# EAGLE design resisitive pos servo2 (EAGLE 6.5.0)
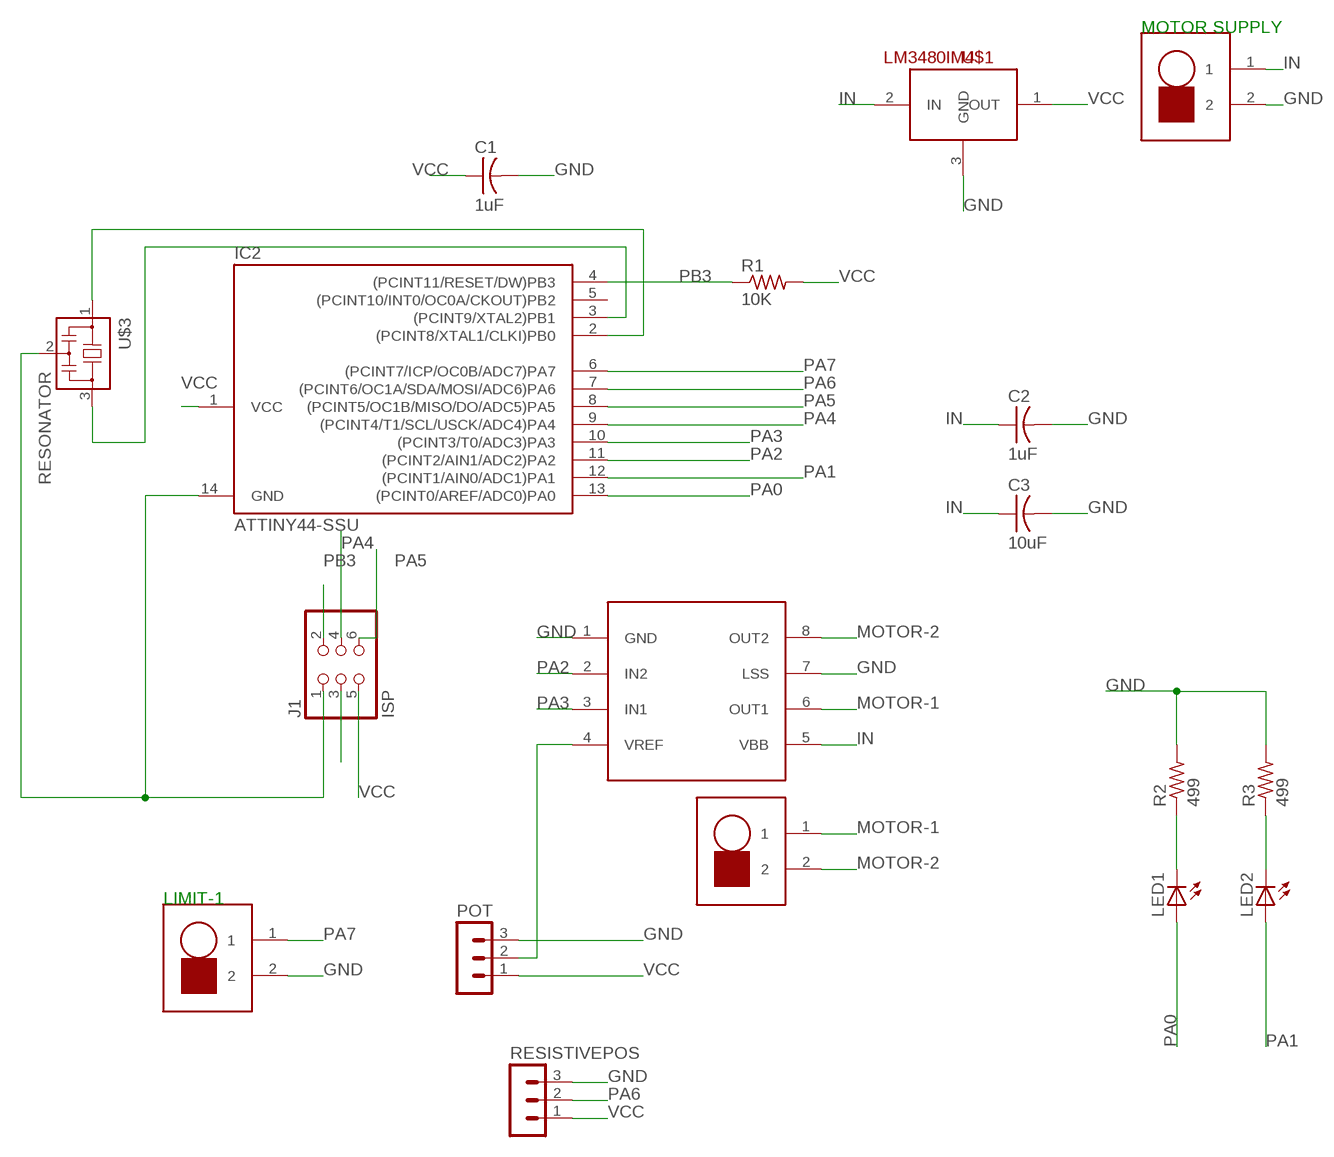
[diagram p0: schematic, sheet 1]

## Parts
C1  1uF  CAP-US1206  [C1206]
C2  1uF  CAP-US1206  [C1206]
C3  10uF  CAP-US1206  [C1206]
IC2  ATTINY44-SSU  [SOIC14]
J1  ISP  PINHD-2X3-SMD  [2X03SMD]
LED1  LEDSMT1206  [1206]
LED2  LEDSMT1206  [1206]
MOTOR-SUPPLY  3.5MMSCREWTERMINAL2  [SCREWTERMINAL-3.5MM-2-NS]
POT  MA03-1  [MA03-1]
R1  10K  RES-US1206FAB  [R1206FAB]
R2  499  RES-US1206FAB  [R1206FAB]
R3  499  RES-US1206FAB  [R1206FAB]
RESISTIVEPOS  MA03-1  [MA03-1]
U$1  LM3480IM4  [SOT23-3]
U$2  3.5MMSCREWTERMINAL2  [SCREWTERMINAL-3.5MM-2-NS]
U$3  RESONATOR  [EFOBM]
U$5  3.5MMSCREWTERMINAL2  [SCREWTERMINAL-3.5MM-2-NS]
U$6  A4953-H-BRIDGE-MOTOR-DRIVER  [SOIC8]

## Nets
GND: C1.2 C2.2 C3.2 IC2.14(GND) J1.1 MOTOR-SUPPLY.2 POT.3 R2.2 R3.2 RESISTIVEPOS.3 U$1.3(GND) U$3.2 U$5.2 U$6.1(GND) U$6.7(LSS)
IN: C2.1 C3.1 MOTOR-SUPPLY.1 U$1.2(IN) U$6.5(VBB)
MOTOR-1: U$2.1 U$6.6(OUT1)
MOTOR-2: U$2.2 U$6.8(OUT2)
N$1: LED1.C R2.1
N$2: IC2.3((PCINT9/XTAL2)PB1) U$3.3
N$3: IC2.2((PCINT8/XTAL1/CLKI)PB0) U$3.1
N$4: LED2.C R3.1
N$5: POT.2 U$6.4(VREF)
PA0: IC2.13((PCINT0/AREF/ADC0)PA0) LED1.A
PA1: IC2.12((PCINT1/AIN0/ADC1)PA1) LED2.A
PA2: IC2.11((PCINT2/AIN1/ADC2)PA2) U$6.2(IN2)
PA3: IC2.10((PCINT3/T0/ADC3)PA3) U$6.3(IN1)
PA4: IC2.9((PCINT4/T1/SCL/USCK/ADC4)PA4) J1.4
PA5: IC2.8((PCINT5/OC1B/MISO/DO/ADC5)PA5) J1.6
PA6: IC2.7((PCINT6/OC1A/SDA/MOSI/ADC6)PA6) J1.3 RESISTIVEPOS.2
PA7: IC2.6((PCINT7/ICP/OC0B/ADC7)PA7) U$5.1
PB3: IC2.4((PCINT11/RESET/DW)PB3) J1.2 R1.1
VCC: C1.1 IC2.1(VCC) J1.5 POT.1 R1.2 RESISTIVEPOS.1 U$1.1(OUT)
Unconnected: IC2.5((PCINT10/INT0/OC0A/CKOUT)PB2)

## Notes on the sheet
- MOTOR SUPPLY
- LIMIT-1

## Library data of the parts
C1-C3 = fab:CAP-US
IC2 = fab:ATTINY44
J1 = fab:PINHD-2X3-SMD: PIN HEADER
LED1 LED2 = adafruit:LED: LED OSRAM: - CHIPLED LG R971, LG N971, LY N971, LG Q971, LY Q971, LO R971, LY R971 LH N974, LH R974 LS Q976, LO Q976, LY Q976 LO Q996 - Hyper CHIPLED LW Q18S LB Q993, LB Q99A, LB R99A - SideLED LS A670, LO A670, LY A670, LG A670, LP A670 LB A673, LV A673, LT A673, LW A673 LH A674 LY A675 LS A676, LA A676, LO A676, LY A676, LW A676 LS A679, LY A679, LG A679 - Hyper Micro SIDELED® LS Y876, LA Y876, LO Y876, LY Y876 LT Y87S - SmartLED LW L88C, LW L88S LB L89C, LB L89S, LG L890 LS L89K, LO L89K, LY L89K LS L896, LA L896, LO L896, LY L896 - TOPLED LS T670, LO T670, LY T670, LG T670, LP T670 LSG T670, LSP T670, LSY T670, LOP T670, LYG T670 LG T671, LOG T671, LSG T671 LB T673, LV T673, LT T673, LW T673 LH T674 LS T676, LA T676, LO T676, LY T676, LB T676, LH T676, LSB T676, LW T676 LB T67C, LV T67C, LT T67C, LS T67K, LO T67K, LY T67K, LW E67C LS E67B, LA E67B, LO E67B, LY E67B, LB E67C, LV E67C, LT E67C LW T67C LS T679, LY T679, LG T679 LS T770, LO T770, LY T770, LG T770, LP T770 LB T773, LV T773, LT T773, LW T773 LH T774 LS E675, LA E675, LY E675, LS T675 LS T776, LA T776, LO T776, LY T776, LB T776 LHGB T686 LT T68C, LB T68C - Hyper Mini TOPLED® LB M676 - Mini TOPLED Santana® LG M470 LS M47K, LO M47K, LY M47K Source: http://www.osram.convergy.de/
MOTOR-SUPPLY U$2 U$5 = cw:3.5MMSCREWTERMINAL2
POT RESISTIVEPOS = con-lstb:MA03-1: PIN HEADER; OC_FARNELL: unknown; OC_NEWARK: unknown
R1-R3 = fab:RES-US: Resistor (US Symbol) Variants with postfix FAB are widened to allow the routing of internal traces
U$1 = SparkFun-PowerIC:LM3480IM4: Small package linear regulator
U$3 = fab:RESONATOR
U$6 = fab:A4953-H-BRIDGE-MOTOR-DRIVER

## Board
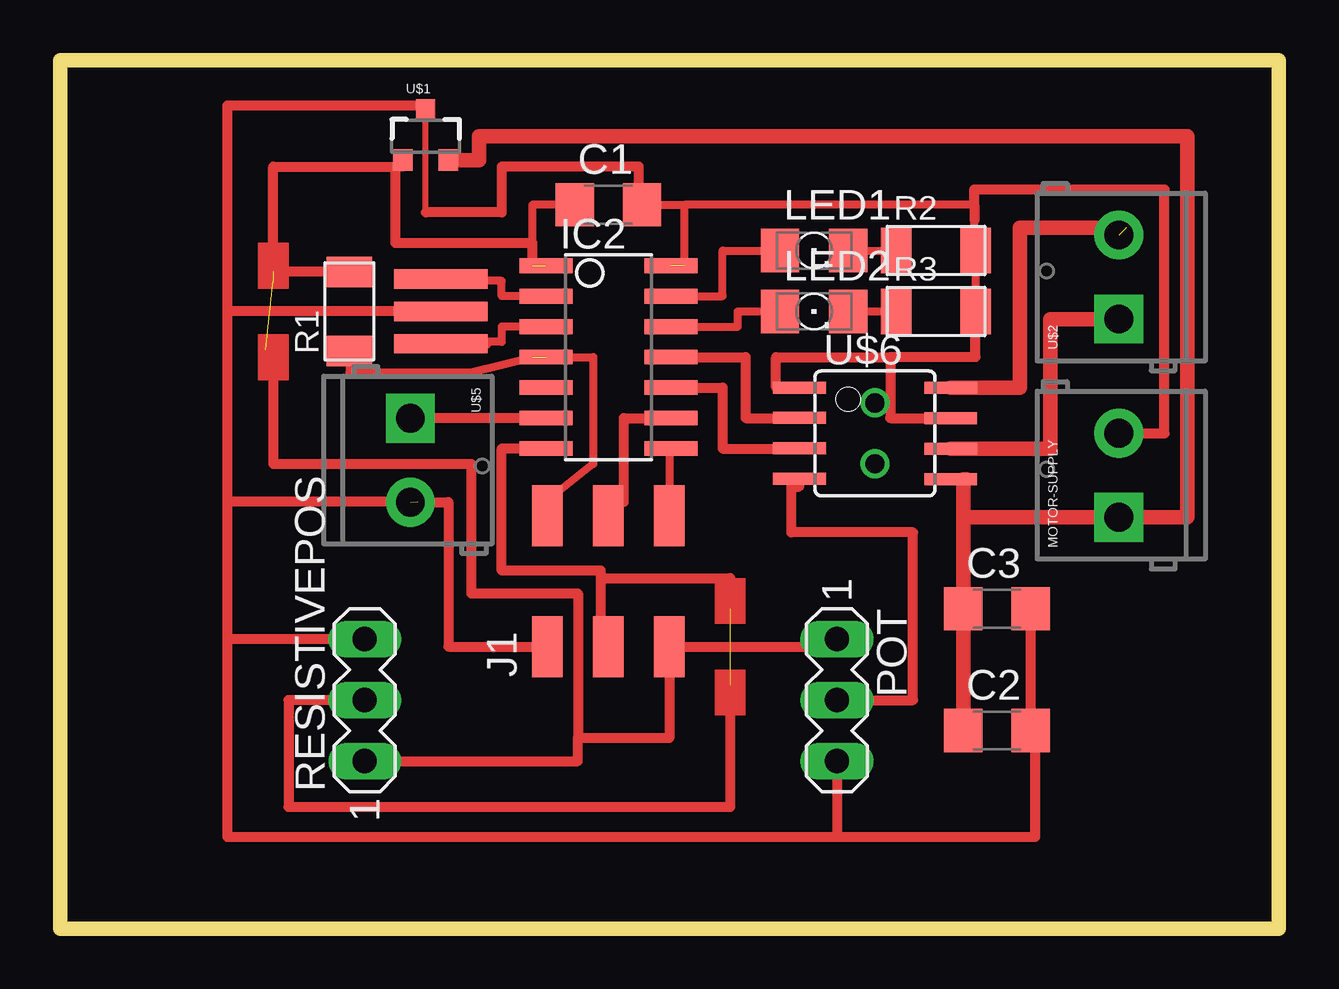
[diagram p1: board, top side]

Size 50.8 x 36.2 mm. Coordinates in mm from the lower left corner, seen from the top.
Outline: 50.8,0 0,0 0,36.2 50.8,36.2 50.8,0
Copper layers (1*16): Top 0.035mm / dielectric 1.5mm / Bottom 0.035mm
Design rules "default *": minimum track width 10mil, minimum drill 24mil, track to track 16mil, track to pad 16mil, pad to pad 16mil, via to via 16mil, smd to smd 16mil, copper to edge 40mil, drill to drill 8mil, minimum pad ring 10mil, minimum via ring 8mil, stop-mask expansion 4mil, vias tented up to drill 0mil, thermal gap 10mil

### Footprints (pad centres in the part's own frame; a part is rotated, then mirrored left to right if it is on the bottom)
C1206 = smd 1.6 x 1.8: 1 -1.4,0; 2 1.4,0
SOIC14 = smd 0.61 x 2.21: 1 -3.81,-2.603; 2 -2.54,-2.603; 3 -1.27,-2.603; 4 0,-2.603; 5 1.27,-2.603; 6 2.54,-2.603; 7 3.81,-2.603; 8 3.81,2.603; 9 2.54,2.603; 10 1.27,2.603; 11 0,2.603; 12 -1.27,2.603; 13 -2.54,2.603; 14 -3.81,2.603
2X03SMD = smd 2.54 x 1.27: 1 -2.54,2.54; 2 2.92,2.54; 3 -2.54,0; 4 2.92,0; 5 -2.54,-2.54; 6 2.92,-2.54
1206 = smd 1.6 x 1.803: A -1.422,0; C 1.422,0
SCREWTERMINAL-3.5MM-2-NS = drill 1.2 pad 2.032 square: 1 0,0 | drill 1.2 pad 2.032: 2 3.5,0
MA03-1 = drill 1.016 long: 1 -2.54,0; 2 0,0; 3 2.54,0
R1206FAB = smd 1.27 x 1.905: 1 -1.651,0; 2 1.651,0
SOT23-3 = smd 0.8 x 0.9: 1 -0.95,-1; 2 0.95,-1; 3 0,1.1
EFOBM = smd 0.8 x 3.9: 1 -1.35,0; 2 0,0; 3 1.35,0
SOIC8 = smd 0.5 x 2.2: 1 -1.905,-3.154; 2 -0.645,-3.154; 3 0.625,-3.154; 4 1.895,-3.154; 5 1.905,3.154; 6 0.635,3.154; 7 -0.635,3.154; 8 -1.905,3.154

### Placement (x,y rotation side)
C1  22.86,30.16 0 top
C2  39.05,8.26 0 top
C3  39.05,13.34 0 top
IC2  22.86,23.81 270 top
J1  22.86,14.29 90 top
LED1  31.43,28.26 0 top
LED2  31.43,25.72 0 top
MOTOR-SUPPLY  44.13,17.14 90 top
POT  32.38,9.53 270 top
R1  12.06,25.72 90 top
R2  36.51,28.26 0 top
R3  36.51,25.72 0 top
RESISTIVEPOS  12.7,9.53 90 top
U$1  15.24,33.02 0 top
U$2  44.13,25.4 90 top
U$3  15.88,25.72 270 top
U$5  14.61,21.27 270 top
U$6  33.97,20.64 270 top

### Tracks (layer width: path | path; a pad name or v marks a point on that pad's centre or on a via)
GND  (2 unrouted)
  Top 0.254: 15.24,29.84 U$1.3
  Top 0.33: 26.04,30.16 C1.2 24.13,30.8 | U$1.3 15.24,34.29 | R3.2 R2.2 38.12,29.53 38.1,30.16 26.04,30.16 | 26.04,27.62 26.04,30.16
  Top 0.406: U$3.2 6.99,25.72 | 15.07,34.29 U$1.3 | MOTOR-SUPPLY.2 46.04,20.64 46.04,30.8 38.1,30.8 38.12,29.53 | 6.99,25.72 6.99,34.29 15.07,34.29 | 15.24,34.29 15.07,34.29 | 14.92,17.78 6.99,17.78 | 6.99,17.78 6.99,25.72 | 6.99,12.06 6.99,3.81 32.38,3.81 | 6.99,12.06 6.99,17.78 | U$5.2 16.19,17.77 16.19,11.75 J1.1 | R3.2 38.16,23.81 34.61,23.81 | U$6.1 29.84,22.54 29.84,23.81 34.61,23.81 | 34.61,23.81 34.61,21.27 U$6.7 | 24.13,30.8 24.13,31.75 18.41,31.75 18.41,29.84 15.24,29.84 | 32.38,3.81 40.64,3.81 40.64,8.26 C2.2 C3.2 | RESISTIVEPOS.3 6.99,12.06 | POT.3 32.38,3.81
IN
  Top 0.406: U$6.5 37.78,18.73
  Top 0.61: C2.1 C3.1 37.65,17.14 | U$1.2 17.46,32.02 17.46,33.02 46.99,33.02 46.99,17.14 MOTOR-SUPPLY.1 37.65,17.14 | 37.78,18.73 37.65,18.73 37.65,17.14
MOTOR-1
  Top 0.61: U$6.6 41.27,20 41.27,25.4 U$2.1
MOTOR-2  (1 unrouted)
  Top 0.406: 44.45,29.21 44.45,29.53
  Top 0.61: U$6.8 40.01,22.54 40.01,29.21 44.45,29.21
N$1
  Top 0.33: LED1.C R2.1
N$2
  Top 0.33: IC2.3 18.41,25.08 18.41,24.45 17.78,24.45
  Top 0.406: U$3.3 17.78,24.37 17.78,24.45
N$3
  Top 0.33: IC2.2 18.41,26.35 18.41,26.99 17.14,26.99 16.51,26.99
  Top 0.406: U$3.1 17.14,27.07 17.14,26.99
N$4
  Top 0.33: LED2.C R3.1
N$5
  Top 0.406: POT.2 35.56,9.53 35.56,16.51 30.48,16.51 30.48,18.41 30.82,18.41 U$6.4
N$6  (via drill 0.8 pad 0.3)
  other vias: 33.97,19.37
N$7  (via drill 0.8 pad 0.3)
  other vias: 33.97,21.91
PA0
  Top 0.33: IC2.13 27.62,26.35 27.62,28.26 LED1.A
PA1
  Top 0.33: IC2.12 28.26,25.08 28.26,25.72 LED2.A
PA2
  Top 0.406: IC2.11 28.57,23.81 28.57,21.27 U$6.2
PA3
  Top 0.406: IC2.10 27.62,22.54 27.62,20 30.81,20 U$6.3
PA4
  Top 0.406: IC2.9 23.5,21.27 23.5,17.78 22.86,17.78 J1.4
PA5
  Top 0.33: IC2.8 25.4,20 25.4,17.46
  Top 0.406: 25.4,17.46 J1.6
PA6  (1 unrouted)
  Top 0.406: IC2.7 18.41,20 18.41,14.92 22.54,14.92 22.54,14.61 | J1.3 22.54,11.75 22.54,14.61 | 22.54,14.61 27.94,14.61 27.94,13.34 | RESISTIVEPOS.2 9.53,9.53 9.53,5.08 27.94,5.08 27.94,10.16
PA7
  Top 0.406: IC2.6 U$5.1
PB3  (1 unrouted)
  Top 0.33: R1.1 12.06,23.18 17.14,23.18 19.68,23.81 22.23,23.81 22.23,19.37 20.64,18.1
  Top 0.406: 20.32,16.83 J1.2 20.32,18.1 20.64,18.1
VCC  (3 unrouted)
  Top 0.33: C1.1 19.68,30.16 19.68,27.94 19.68,27.62
  Top 0.406: 9.21,23.81 8.89,23.81 | 8.89,23.81 8.57,24.13 | 8.89,23.81 8.89,19.37 17.14,19.37 17.14,13.97 21.59,13.97 21.59,7.94 | 21.59,7.94 25.4,7.94 J1.5 32.38,11.75 POT.1 | 8.89,26.99 8.89,31.75 13.97,31.75 | U$1.1 14.29,31.75 13.97,31.75 | R1.2 8.89,27.37 | 13.97,31.75 13.97,28.57 19.68,28.57 19.68,27.94 | RESISTIVEPOS.1 21.59,6.99 21.59,7.94
(copper drawn outside any net)
  shapes: Top area x4